# EAGLE design lamp7 (EAGLE 7.7.0)
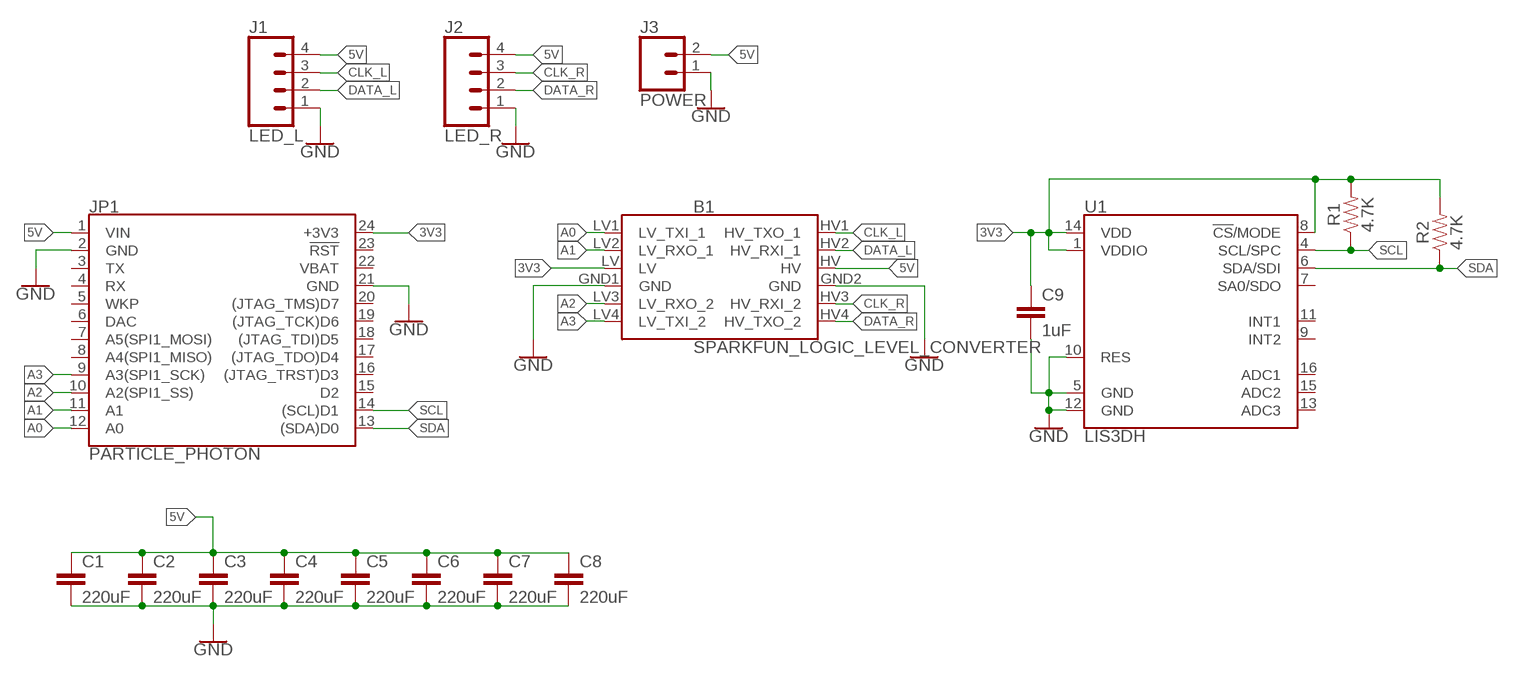
[diagram p0: schematic, sheet 1]

## Parts
B1  SPARKFUN_LOGIC_LEVEL_CONVERTER  [SPARKFUN_LOGIC_LEVEL_CONVERTER]
C1  220uF  2.2UF-1206-50V-10%  [1206]
C2  220uF  2.2UF-1206-50V-10%  [1206]
C3  220uF  2.2UF-1206-50V-10%  [1206]
C4  220uF  2.2UF-1206-50V-10%  [1206]
C5  220uF  2.2UF-1206-50V-10%  [1206]
C6  220uF  2.2UF-1206-50V-10%  [1206]
C7  220uF  2.2UF-1206-50V-10%  [1206]
C8  220uF  2.2UF-1206-50V-10%  [1206]
C9  1uF  0.1UF-0603-25V-(+80/-20%)  [0603]
J1  LED_L  CONN_04LONGPADS  [1X04_LONGPADS]
J2  LED_R  CONN_04LONGPADS  [1X04_LONGPADS]
J3  POWER  CONN_02LOCK_LONGPADS  [1X02_LOCK_LONGPADS]
JP1  PARTICLE_PHOTON  [PARTICLE_PHOTON]
R1  4.7K  0OHM-0603-1/10W-5%  [0603]
R2  4.7K  0OHM-0603-1/10W-5%  [0603]
U1  LIS3DH  [LGA-16-3X3]

## Nets
3V3: B1.LV C9.1 JP1.24(+3V3) R1.2 R2.2 U1.1(VDDIO) U1.8(!CS!/MODE) U1.14(VDD)
5V: B1.HV C1.1 C2.1 C3.1 C4.1 C5.1 C6.1 C7.1 C8.1 J1.4 J2.4 J3.2 JP1.1(VIN)
A0: B1.LV1(LV_TXI_1) JP1.12(A0)
A1: B1.LV2(LV_RXO_1) JP1.11(A1)
A2: B1.LV3(LV_RXO_2) JP1.10(A2(SPI1_SS))
A3: B1.LV4(LV_TXI_2) JP1.9(A3(SPI1_SCK))
CLK_L: B1.HV1(HV_TXO_1) J1.3
CLK_R: B1.HV3(HV_RXI_2) J2.3
DATA_L: B1.HV2(HV_RXI_1) J1.2
DATA_R: B1.HV4(HV_TXO_2) J2.2
GND: B1.GND1(GND) B1.GND2(GND) C1.2 C2.2 C3.2 C4.2 C5.2 C6.2 C7.2 C8.2 C9.2 J1.1 J2.1 J3.1 JP1.2(GND) JP1.21(GND) U1.5(GND) U1.10(RES) U1.12(GND)
SCL: JP1.14((SCL)D1) R1.1 U1.4(SCL/SPC)
SDA: JP1.13((SDA)D0) R2.1 U1.6(SDA/SDI)
Unconnected: JP1.3(TX) JP1.4(RX) JP1.5(WKP) JP1.6(DAC) JP1.7(A5(SPI1_MOSI)) JP1.8(A4(SPI1_MISO)) JP1.15(D2) JP1.16((JTAG_TRST)D3) JP1.17((JTAG_TDO)D4) JP1.18((JTAG_TDI)D5) JP1.19((JTAG_TCK)D6) JP1.20((JTAG_TMS)D7) JP1.23(!RST!) U1.7(SA0/SDO) U1.9(INT2) U1.11(INT1) U1.13(ADC3) U1.15(ADC2) U1.16(ADC1)

## Power pins joined to a net without a drawn wire
VBAT: JP1.22(VBAT)

## Library data of the parts
B1 = SparkFun-Boards:SPARKFUN_LOGIC_LEVEL_CONVERTER: SparkFun Logic Level Converter -Bi-Directional This is the mechnical outline for the 3.3V - 5V bi directional logic level converter. *Note, the "LOCK" Package has the header pins staggered by an offset of 5 mils (off center line), so that when you slide a row of standard 0.1" headers into the PTH pads, it will hold position vertically. See the follwing turorial for more information on this type of special footprints: Sneaky Footprints <https://www.sparkfun.com/tutorials/114> SparkFun Products: SparkFun Logic Level Converter - Bi-Directional <https://www.sparkfun.com/products/12009>
C1-C8 = SparkFun-Capacitors:2.2UF: 2.2µF ceramic capacitors A capacitor is a passive two-terminal electrical component used to store electrical energy temporarily in an electric field.; PROD_ID: CAP-10009; VALUE: 2.2uF
C9 = SparkFun-Capacitors:0.1UF: 0.1µF ceramic capacitors A capacitor is a passive two-terminal electrical component used to store electrical energy temporarily in an electric field.; PROD_ID: CAP-00810; VALUE: 0.1uF
J1 J2 = SparkFun-Connectors:CONN_04: Multi connection point. Often used as Generic Header-pin footprint for 0.1 inch spaced/style header connections On any of the 0.1 inch spaced packages, you can populate with these: Break Away Headers - Straight <https://www.sparkfun.com/products/116> (PRT-00116) Break Away Male Headers - Right Angle <https://www.sparkfun.com/products/553> (PRT-00553) Female Headers <https://www.sparkfun.com/products/115> (PRT-00115) Break Away Headers - Machine Pin <https://www.sparkfun.com/products/117> (PRT-00117) Break Away Female Headers - Swiss Machine Pin <https://www.sparkfun.com/products/743> (PRT-00743) For SCREWTERMINALS and SPRING TERMINALS visit here: Screw Terimnals on SparkFun.com <https://www.sparkfun.com/search/results?term=Screw+Terminals> (5mm/3.5mm/2.54mm spacing) This device is also useful as a general connection point to wire up your design to another part of your project. Our various solder wires solder well into these plated through hole pads. Hook-Up Wire - Assortment (Stranded, 22 AWG) <https://www.sparkfun.com/products/11375> (PRT-11375) Hook-Up Wire - Assortment (Solid Core, 22 AWG) <https://www.sparkfun.com/products/11367> (PRT-11367) View the entire wire category on our website here <https://www.sparkfun.com/categories/141> Special notes: Molex polarized connector foot print use with SKU : PRT-08231 with associated crimp pins and housings. 1MM SMD Version SKU: PRT-10208; PROD_ID: CONN-09696
J3 = SparkFun-Connectors:CONN_02: Multi connection point. Often used as Generic Header-pin footprint for 0.1 inch spaced/style header connections On any of the 0.1 inch spaced packages, you can populate with these: Break Away Headers - Straight <https://www.sparkfun.com/products/116> (PRT-00116) Break Away Male Headers - Right Angle <https://www.sparkfun.com/products/553> (PRT-00553) Female Headers <https://www.sparkfun.com/products/115> (PRT-00115) Break Away Headers - Machine Pin <https://www.sparkfun.com/products/117> (PRT-00117) Break Away Female Headers - Swiss Machine Pin <https://www.sparkfun.com/products/743> (PRT-00743) For SCREWTERMINALS and SPRING TERMINALS visit here: Screw Terimnals on SparkFun.com <https://www.sparkfun.com/search/results?term=Screw+Terminals> (5mm/3.5mm/2.54mm spacing) This device is also useful as a general connection point to wire up your design to another part of your project. Our various solder wires solder well into these plated through hole pads. Hook-Up Wire - Assortment (Stranded, 22 AWG) <https://www.sparkfun.com/products/11375> (PRT-11375) Hook-Up Wire - Assortment (Solid Core, 22 AWG) <https://www.sparkfun.com/products/11367> (PRT-11367) View the entire wire category on our website here <https://www.sparkfun.com/categories/141> Special notes: Molex polarized connector foot print use with: PRT-08233 with associated crimp pins and housings. 2.54_SCREWTERM for use with PRT-10571. 3.5mm Screw Terminal footprints for PRT-08084 5mm Screw Terminal footprints for use with PRT-08432
JP1 = SparkFun-Boards:PARTICLE_PHOTON: Particle Photon Footprint of the Particle Photon that is used as a basis for many Photon shields. SparkFun Products: Particle Photon <https://www.sparkfun.com/products/13764> SparkFun Photon ProtoShield <https://www.sparkfun.com/products/13598> SparkFun Photon micro OLED Shield <https://www.sparkfun.com/products/13628> SparkFun Photon IMU Shield <https://www.sparkfun.com/products/13629> SparkFun Photon Battery Shield <https://www.sparkfun.com/products/13626>
R1 R2 = SparkFun-Resistors:0OHM: 0Ω resistor A resistor is a passive two-terminal electrical component that implements electrical resistance as a circuit element. Resistors act to reduce current flow, and, at the same time, act to lower voltage levels within circuits. - Wikipedia; PROD_ID: RES-08609; VALUE: 0
U1 = SparkFun-Sensors:LIS3DH: ST Microelectronics LIS3DH 3-Axis ±2/4/8/16g SPI/I2C Accelerometer The LIS3DH is a three axis MEMS linear accelerometer in the "nano" family. It has a digital I2C/SPI serial interface which makes it ideal for using in embedded applications. The device also features ultra low-power operational modes that allow advanced power saving and smart sleep to wake-up functions, built in detections with interrupts, and auxiliary ADC inputs Datasheet-XXXX <http://www.sparkfun.com/datasheets/Sensors/Accelerometer/LIS3DH.pdf> SparkFun Products SparkFun Triple Axis Accelerometer Breakout - LIS3DH <https://www.sparkfun.com/products/10345> (SEN-XXXXX) Triple Axis Accelerometer - LIS3DH <https://www.sparkfun.com/products/9755> (SEN-XXXXX); PROD_ID: IC-13419; SF_ID: N/A

## Board
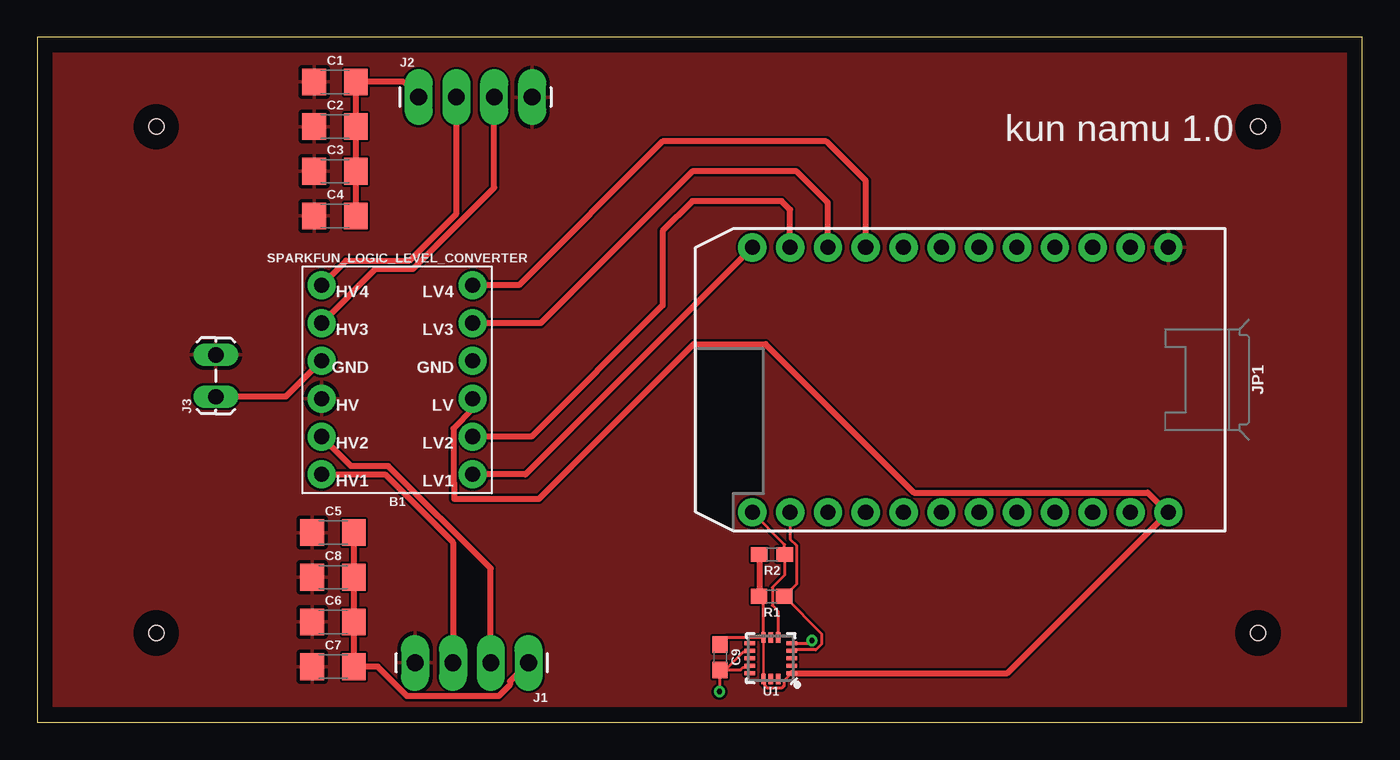
[diagram p1: board, top side]
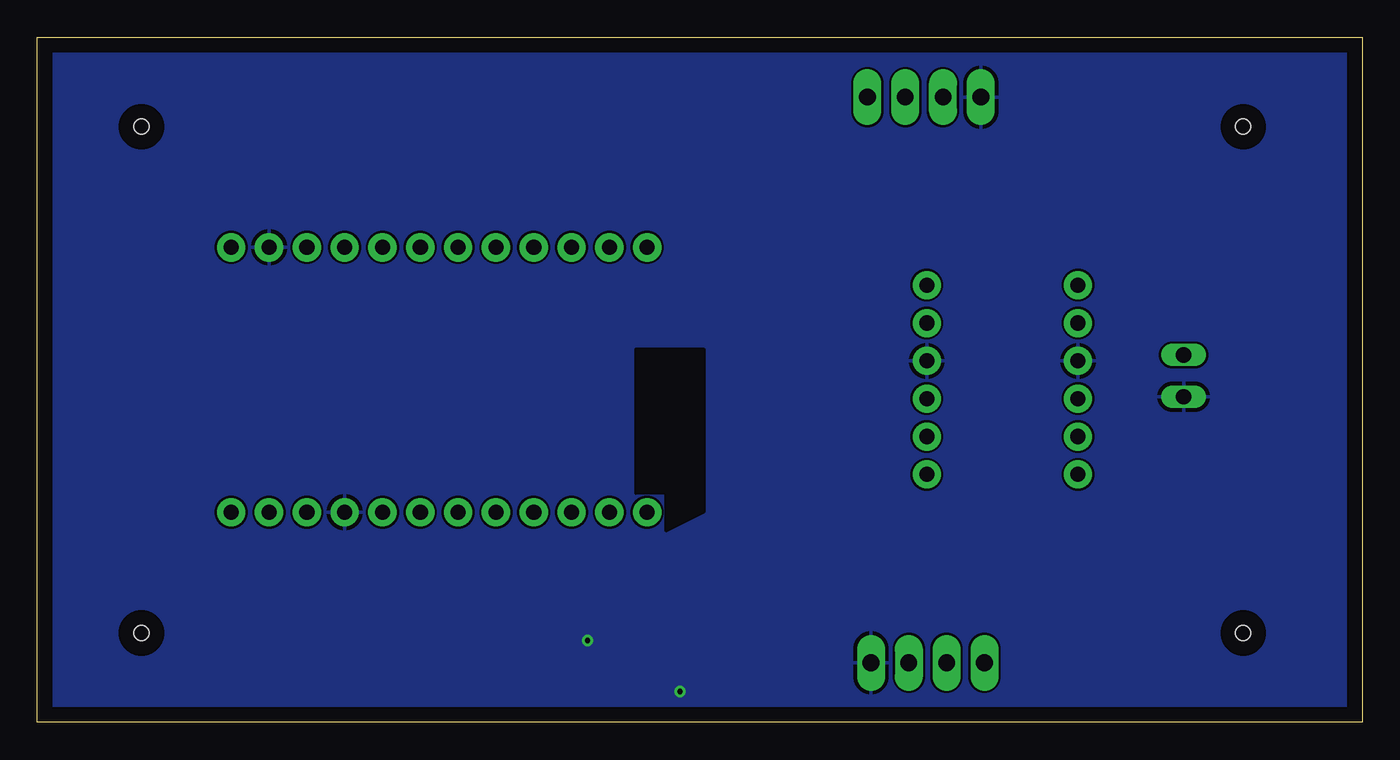
[diagram p2: board, bottom side, seen from below]

Size 89 x 46 mm. Coordinates in mm from the lower left corner, seen from the top.
Outline: 0,0 89,0 89,46 0,46 0,0
Copper layers (1*16): Top 0.035mm / dielectric 1.5mm / Bottom 0.035mm
Design rules "default": minimum track width 6mil, minimum drill 0.35mm, track to track 6mil, track to pad 6mil, pad to pad 6mil, via to via 6mil, smd to smd 6mil, copper to edge 40mil, drill to drill 6mil, minimum pad ring 10mil, minimum via ring 8mil, stop-mask expansion 4mil, vias tented up to drill 0mil, thermal gap 10mil
Holes 1 mm at 8,40 8,6 82,40 82,6

### Footprints (pad centres in the part's own frame; a part is rotated, then mirrored left to right if it is on the bottom)
SPARKFUN_LOGIC_LEVEL_CONVERTER = drill 1.016 pad 1.88: GND1 -5.08,-1.27; GND2 5.08,-1.27; HV 5.08,1.27; HV1 5.08,6.35; HV2 5.08,3.81; HV3 5.08,-3.81; HV4 5.08,-6.35; LV -5.08,1.27; LV1 -5.08,6.35; LV2 -5.08,3.81; LV3 -5.08,-3.81; LV4 -5.08,-6.35
1206 = smd 1.6 x 1.8: 1 -1.4,0; 2 1.4,0
0603 = smd 1.1 x 1: 1 -0.85,0; 2 0.85,0
1X04_LONGPADS = drill 1.118 pad 1.88 long: 1 0,0; 2 2.54,0; 3 5.08,0; 4 7.62,0
1X02_LOCK_LONGPADS = drill 1.016 long: 1 -0.127,0; 2 2.667,0
PARTICLE_PHOTON = drill 1.016 pad 1.905: 1 -8.89,13.97; 2 -8.89,11.43; 3 -8.89,8.89; 4 -8.89,6.35; 5 -8.89,3.81; 6 -8.89,1.27; 7 -8.89,-1.27; 8 -8.89,-3.81; 9 -8.89,-6.35; 10 -8.89,-8.89; 11 -8.89,-11.43; 12 -8.89,-13.97; 13 8.89,-13.97; 14 8.89,-11.43; 15 8.89,-8.89; 16 8.89,-6.35; 17 8.89,-3.81; 18 8.89,-1.27; 19 8.89,1.27; 20 8.89,3.81; 21 8.89,6.35; 22 8.89,8.89; 23 8.89,11.43; 24 8.89,13.97
LGA-16-3X3 = smd 0.7 x 0.28: 1 -1.4,1; 2 -1.4,0.5; 3 -1.4,0; 4 -1.4,-0.5; 5 -1.4,-1; 9 1.4,-1; 10 1.4,-0.5; 11 1.4,0; 12 1.4,0.5; 13 1.4,1 | smd 0.28 x 0.7: 6 -0.5,-1.4; 7 0,-1.4; 8 0.5,-1.4; 14 0.5,1.4; 15 0,1.4; 16 -0.5,1.4

### Placement (x,y rotation side)
B1  24.17,23 180 top
C1  20,43 0 top
C2  20,40 0 top
C3  20,37 0 top
C4  20,34 0 top
C5  19.87,12.74 0 top
C6  19.87,6.74 0 top
C7  19.87,3.74 0 top
C8  19.87,9.74 0 top
C9  45.86,4.37 270 top
J1  33,4 180 top
J2  25.62,41.98 0 top
J3  12,22 90 top
JP1  62,23 270 top
R1  49.33,8.46 180 top
R2  49.35,11.27 180 top
U1  49.27,4.3 180 top

### Tracks (layer width: path | path; a pad name or v marks a point on that pad's centre or on a via)
3V3
  Top 0.152: U1.14 U1.8
  Top 0.203: U1.14 48.88,2.79 48.88,2.45 49.02,2.3 50.02,2.3 50.16,2.45 50.16,2.79 U1.1 | C9.1 46.34,5.7 U1.8 48.77,8.16 R1.2
  Top 0.406: U1.1 65.16,3.3 75.93,14.07 | 75.93,14.07 JP1.24 | R2.2 48.5,8.48 R1.2 | B1.LV 29.25,21.02 27.96,19.73 27.96,16.11 28,16.07 28,15 33.71,15 44.09,25.39 48.92,25.39 58.89,15.42 74.58,15.42 75.93,14.07
5V
  pour Top: 0,0 0,46 89,46 89,0
A0
  Top 0.406: JP1.12 32.79,16.65 B1.LV1
A1
  Top 0.406: JP1.11 50.57,34.43 50,35 44,35 42,33 42,28 33.19,19.19 B1.LV2
A2
  Top 0.406: JP1.10 53.11,34.89 51,37 44,37 33.81,26.81 B1.LV3
A3
  Top 0.406: JP1.9 55.65,36.35 53,39 42,39 32.35,29.35 B1.LV4
CLK_L
  Top 0.406: B1.HV1 23.35,16.65 27.92,12.08 J1.3
CLK_R
  Top 0.406: B1.HV3 22.73,30.44 25.23,30.44 30.7,35.91 J2.3
DATA_L
  Top 0.406: B1.HV2 21.07,17.21 23.58,17.21 30.46,10.33 J1.2
DATA_R
  Top 0.406: B1.HV4 20.74,31 25,31 28.16,34.16 J2.2
GND  (via drill 0.35)
  Top 0.203: U1.5 51.85,5.3 v52.04,5.49 | v45.82,2.06 45.86,2.1 C9.2 | U1.12 47.76,3.69 47.41,3.69 47.24,3.52 C9.2 | U1.10 47.76,4.7 47.41,4.7 46.24,3.52 C9.2
  Top 0.406: J1.1 31.75,2.75 31.75,2.52 31,1.76 24.84,1.76 22.87,3.74 C7.2 C6.2 C8.2 C5.2 | B1.GND2 16.7,21.87 J3.1 | J2.1 24.6,43 C1.2 C2.2 C3.2 C4.2
  pour Bottom: 0,0 0,46 89,46 89,0
SCL
  Top 0.203: JP1.14 50.57,12.31 51,11.88 51,9.28 R1.1 52.67,5.96 52.67,5.23 52.3,4.86 50.73,4.86 U1.4
SDA
  Top 0.203: U1.6 49.77,7.45 49.37,7.85 49.37,9.06 50.2,9.89 R2.1 50.2,11.94 JP1.13

### Text on the board
tNames: kun namu 1.0